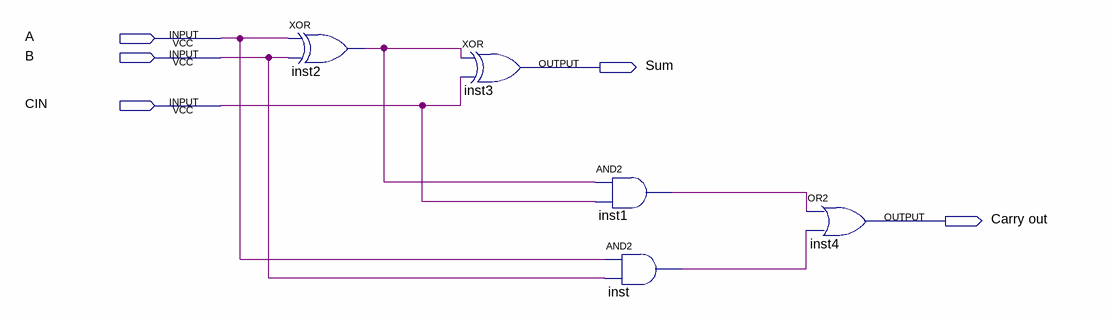
[diagram p0: schematic sheet]
// Quartus schematic Block1.bdf as structural Verilog: 5 symbols, 5 pins
module Block1 (
  input  A,
  input  B,
  input  CIN,
  output Sum,
  output \Carry_out 
);

  wire inst1_out, inst2_out, inst_out;

  xor inst2 (inst2_out, A, B);
  xor inst3 (Sum, inst2_out, CIN);
  and inst1 (inst1_out, inst2_out, CIN);
  and inst (inst_out, A, B);
  or inst4 (\Carry_out , inst1_out, inst_out);
endmodule
